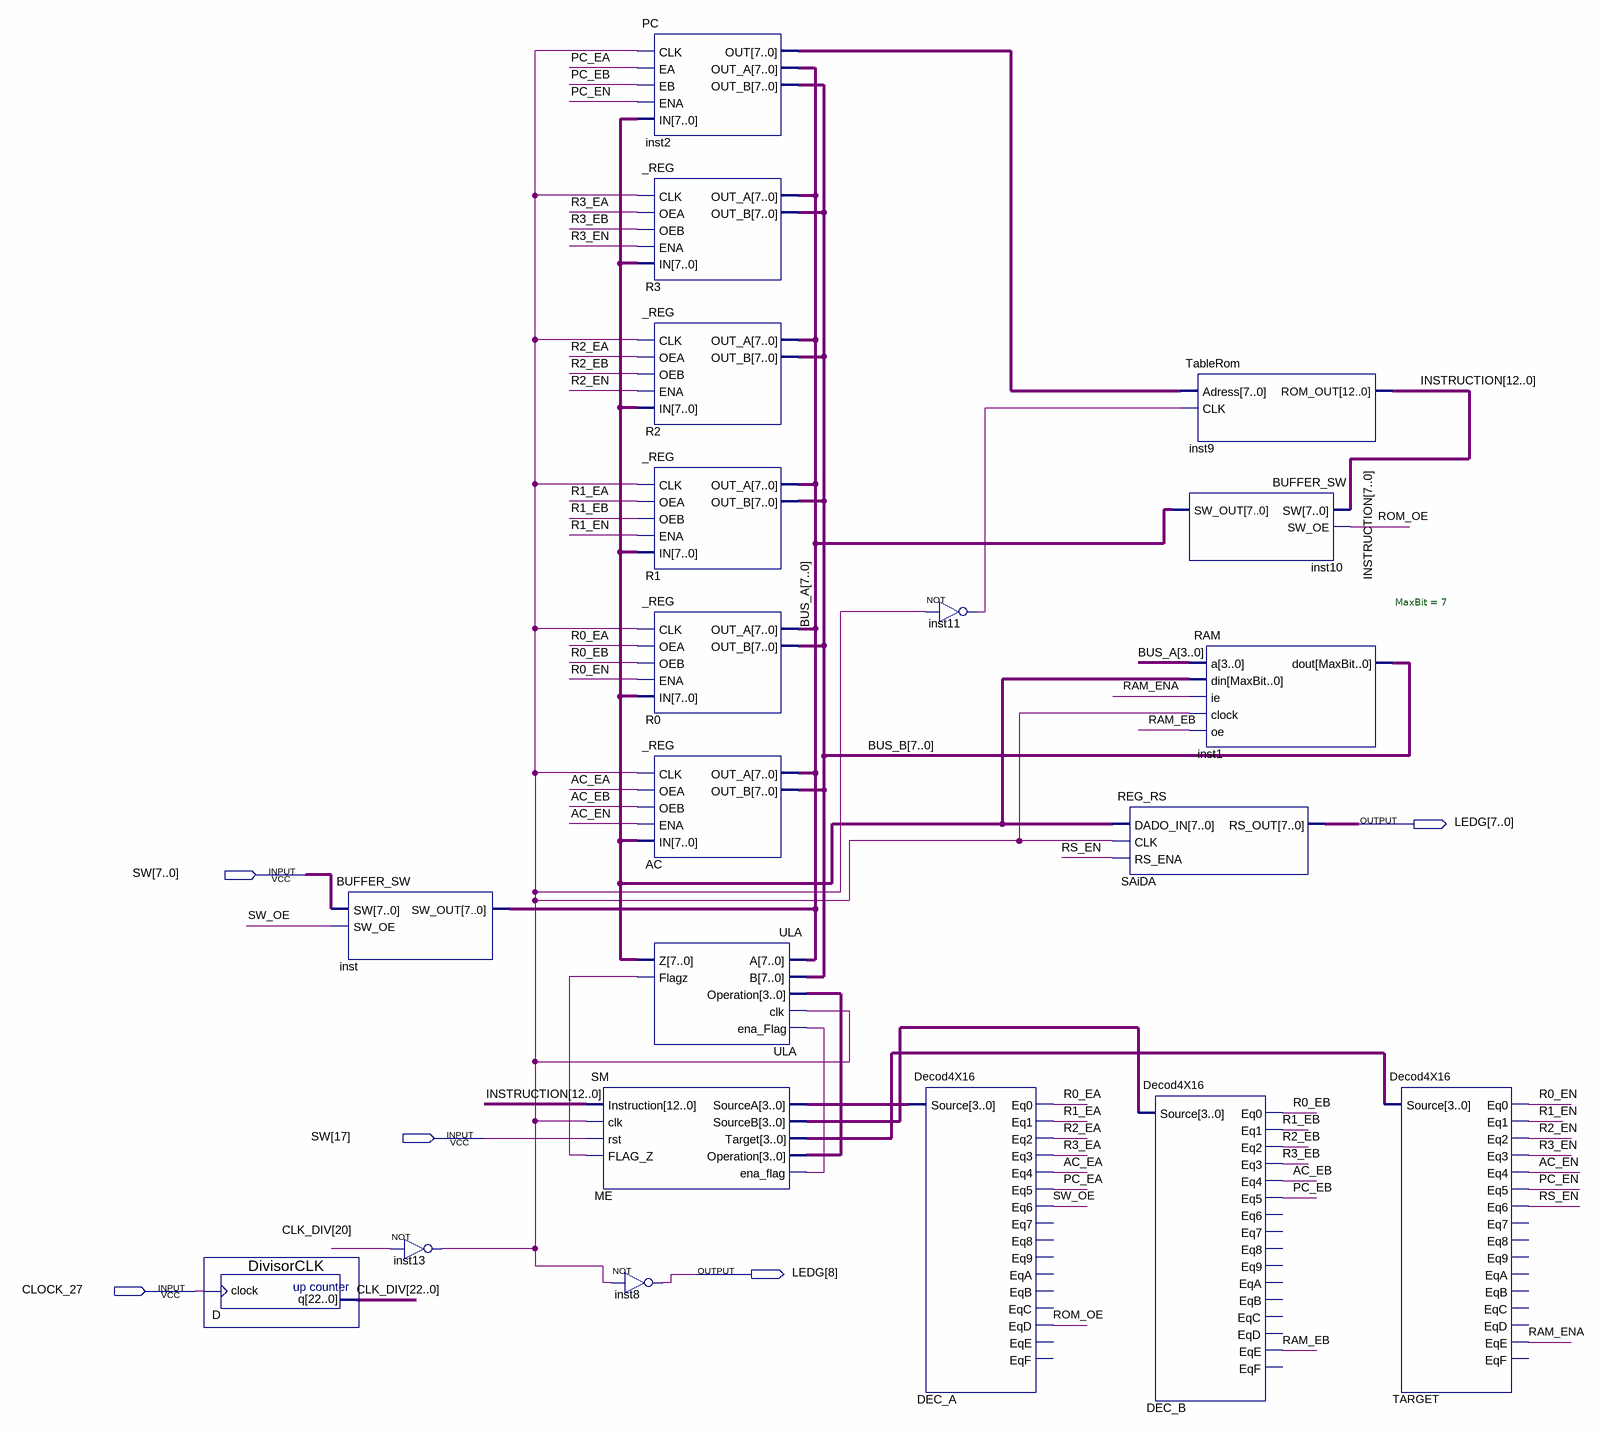
[diagram p0: schematic sheet]
// Quartus schematic LAB4.bdf as structural Verilog: 20 symbols, 5 pins
module LAB4 (
  input  [17:0] SW,
  input  CLOCK_27,
  output [8:0] LEDG
);

  wire AC_EA, AC_EB, AC_EN, inst11_out, inst13_out, ME_ena_flag, PC_EA, PC_EB, PC_EN, R0_EA, R0_EB, R0_EN,
       R1_EA, R1_EB, R1_EN, R2_EA, R2_EB, R2_EN, R3_EA, R3_EB, R3_EN, RAM_EB, RAM_ENA, ROM_OE, RS_EN, SW_OE,
       ULA_flagz;
  wire [3:0] ME_operation, ME_sourcea, ME_sourceb, ME_target;
  wire [7:0] BUS_A, BUS_B, inst2_out, ULA_z;
  wire [12:0] INSTRUCTION;
  wire [22:0] CLK_DIV;

  DivisorCLK D (.clock(CLOCK_27), .q(CLK_DIV));
  BUFFER_SW inst (.SW(SW[7:0]), .SW_OE(SW_OE), .SW_OUT(BUS_A));
  not inst13 (inst13_out, CLK_DIV[20]);
  PC inst2 (
    .CLK(inst13_out), .EA(PC_EA), .EB(PC_EB), .ENA(PC_EN), .IN(ULA_z), .OUT(inst2_out), .OUT_A(BUS_A),
    .OUT_B(BUS_B));
  _REG R3 (.CLK(inst13_out), .OEA(R3_EA), .OEB(R3_EB), .ENA(R3_EN), .IN(ULA_z), .OUT_A(BUS_A), .OUT_B(BUS_B));
  _REG R2 (.CLK(inst13_out), .OEA(R2_EA), .OEB(R2_EB), .ENA(R2_EN), .IN(ULA_z), .OUT_A(BUS_A), .OUT_B(BUS_B));
  _REG R1 (.CLK(inst13_out), .OEA(R1_EA), .OEB(R1_EB), .ENA(R1_EN), .IN(ULA_z), .OUT_A(BUS_A), .OUT_B(BUS_B));
  _REG R0 (.CLK(inst13_out), .OEA(R0_EA), .OEB(R0_EB), .ENA(R0_EN), .IN(ULA_z), .OUT_A(BUS_A), .OUT_B(BUS_B));
  _REG AC (.CLK(inst13_out), .OEA(AC_EA), .OEB(AC_EB), .ENA(AC_EN), .IN(ULA_z), .OUT_A(BUS_A), .OUT_B(BUS_B));
  ULA ULA (
    .A(BUS_A), .B(BUS_B), .Operation(ME_operation), .clk(inst13_out), .ena_Flag(ME_ena_flag), .Z(ULA_z),
    .Flagz(ULA_flagz));
  SM ME (
    .Instruction(INSTRUCTION), .clk(inst13_out), .rst(SW[17]), .FLAG_Z(ULA_flagz), .SourceA(ME_sourcea),
    .SourceB(ME_sourceb), .Target(ME_target), .Operation(ME_operation), .ena_flag(ME_ena_flag));
  not inst8 (LEDG[8], inst13_out);
  Decod4X16 DEC_A (
    .Source(ME_sourcea), .Eq0(R0_EA), .Eq1(R1_EA), .Eq2(R2_EA), .Eq3(R3_EA), .Eq4(AC_EA), .Eq5(PC_EA),
    .Eq6(SW_OE), .EqD(ROM_OE));  // open: Eq7, Eq8, Eq9, EqA, EqB, EqC, EqE, EqF
  not inst11 (inst11_out, inst13_out);
  REG_RS SAiDA (.DADO_IN(ULA_z), .CLK(inst13_out), .RS_ENA(RS_EN), .RS_OUT(LEDG[7:0]));
  TableRom inst9 (.Adress(inst2_out), .CLK(inst11_out), .ROM_OUT(INSTRUCTION));
  BUFFER_SW inst10 (.SW(INSTRUCTION[7:0]), .SW_OE(ROM_OE), .SW_OUT(BUS_A));
  Decod4X16 DEC_B (
    .Source(ME_sourceb), .Eq0(R0_EB), .Eq1(R1_EB), .Eq2(R2_EB), .Eq3(R3_EB), .Eq4(AC_EB), .Eq5(PC_EB),
    .EqE(RAM_EB));  // open: Eq6, Eq7, Eq8, Eq9, EqA, EqB, EqC, EqD, EqF
  RAM #(.MaxBit(7)) inst1 (.a(BUS_A[3:0]), .din(ULA_z), .ie(RAM_ENA), .clock(inst13_out), .oe(RAM_EB), .dout(BUS_B));
  Decod4X16 TARGET (
    .Source(ME_target), .Eq0(R0_EN), .Eq1(R1_EN), .Eq2(R2_EN), .Eq3(R3_EN), .Eq4(AC_EN), .Eq5(PC_EN),
    .Eq6(RS_EN), .EqE(RAM_ENA));  // open: Eq7, Eq8, Eq9, EqA, EqB, EqC, EqD, EqF
endmodule
